# EAGLE design JustSensor (EAGLE 6.6.0)
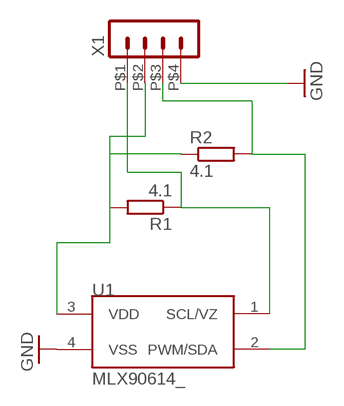
[diagram p0: schematic, sheet 1]

## Parts
R1  4.1  R-EU_0204/7  [0204/7]
R2  4.1  R-EU_0204/7  [0204/7]
U1  MLX90614_  [TO-39]
X1  HEADER_POS4_43045-0401  [43045-0400]

## Nets
GND: U1.4(VSS) X1.P$4
N$1: R1.2 R2.1 U1.3(VDD) X1.P$2
N$2: R1.1 U1.1(SCL/VZ) X1.P$1
N$3: R2.2 U1.2(PWM/SDA) X1.P$3

## Library data of the parts
R1 R2 = rcl:R-EU_: RESISTOR, European symbol
U1 = SparkFun-Sensors:MLX90614: Non-contact PIR I2C interface temperature sensor
X1 = con-molex-micro-fit-3_0:HEADER_POS4_?: Molex - Micro-Fit 3.0 Series connector, 3.00mm (0.118") pitch header, 4 positions.

## Board
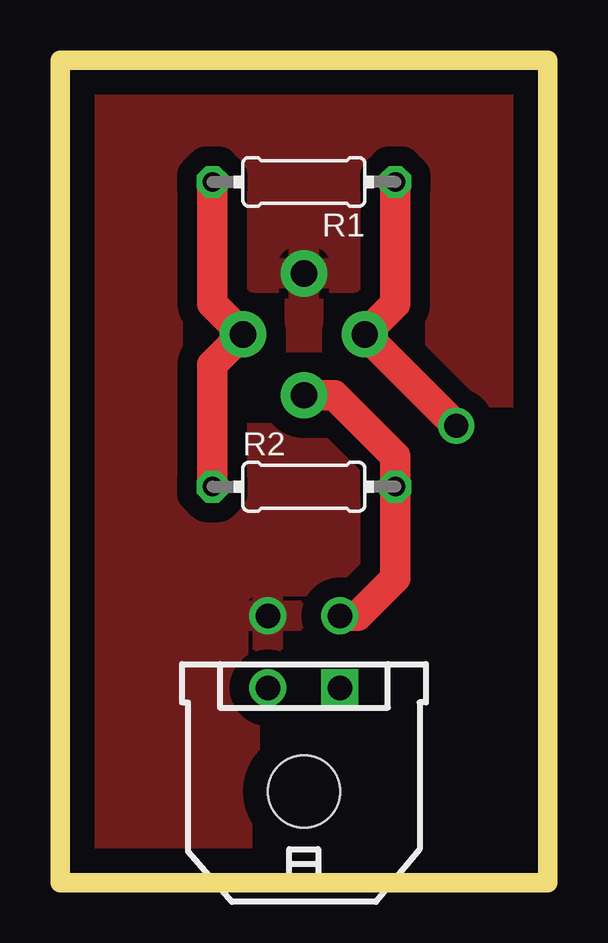
[diagram p1: board, top side]
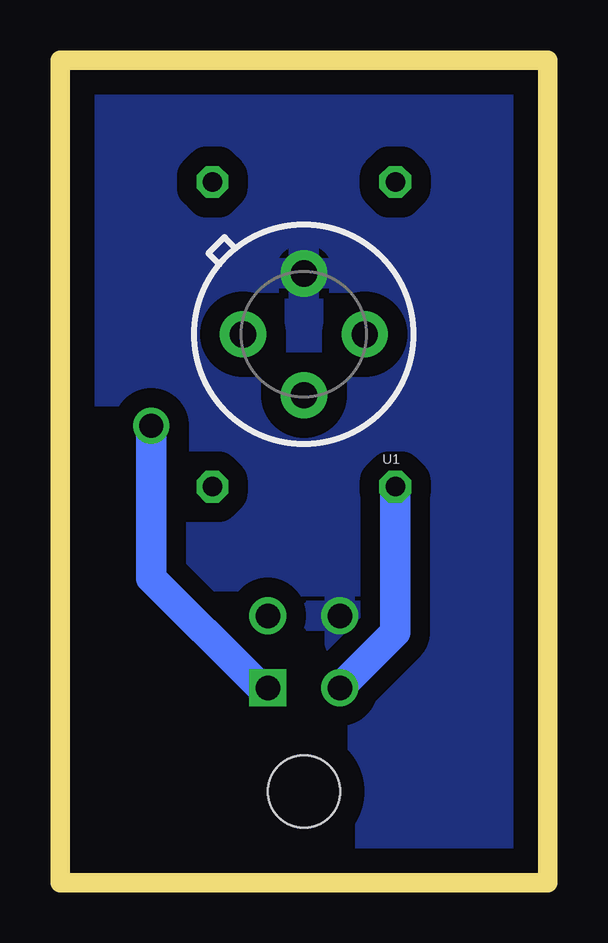
[diagram p2: board, bottom side, seen from below]

Size 20.32 x 34.29 mm. Coordinates in mm from the lower left corner, seen from the top.
Outline: 0,0 20.32,0 20.32,34.29 0,34.28 0,0
Copper layers (1*16): Top 0.035mm / dielectric 1.5mm / Bottom 0.035mm
Design rules "default": minimum track width 10mil, minimum drill 24mil, track to track 8mil, track to pad 8mil, pad to pad 8mil, via to via 8mil, smd to smd 8mil, copper to edge 40mil, drill to drill 8mil, minimum pad ring 10mil, minimum via ring 8mil, stop-mask expansion 4mil, vias tented up to drill 0mil, thermal gap 10mil

### Footprints (pad centres in the part's own frame; a part is rotated, then mirrored left to right if it is on the bottom)
0204/7 = drill 0.813 octagon: 1 -3.81,0; 2 3.81,0
TO-39 = drill 1.1 pad 1.93: 1 2.54,0; 2 0,2.54; 3 -2.54,0; 4 0,-2.54
43045-0400 = drill 1.02 square: P$1 1.5,4.32 | drill 1.02: P$2 -1.5,4.32; P$3 1.5,7.32; P$4 -1.5,7.32 | hole 3: 0,0

### Placement (x,y rotation side)
R1  10.16,29.21 180 top
R2  10.16,16.51 0 top
U1  10.16,22.86 180 bottom
X1  10.16,3.81 0 top

### Tracks (layer width: path | path; a pad name or v marks a point on that pad's centre or on a via)
GND
  pour Bottom (isolate 0.813): 0,34.29 20.32,34.29 20.32,0 0,0
  pour Top (isolate 0.813): 0,34.29 20.32,34.29 20.32,0 0,0
N$1
  Top 1.27: R2.1 6.35,21.59 U1.3 6.35,24.13 R1.2
  Bottom 1.27: X1.P$2 6.35,10.44 R2.1
N$2  (via drill 1)
  Top 1.27: R1.1 13.97,24.13 U1.1 v16.51,19.05
  Bottom 1.27: v16.51,19.05 16.51,12.7 12.13,8.32 arc-45 11.68,8.13 X1.P$1
N$3
  Top 1.27: X1.P$3 12.4,11.13 13.97,12.7 R2.2 13.97,17.78 11.43,20.32 U1.2